# Altium schematic sheet main.SchDoc
size 420 x 297 mm; SheetNumber: 1; SheetTotal: 5
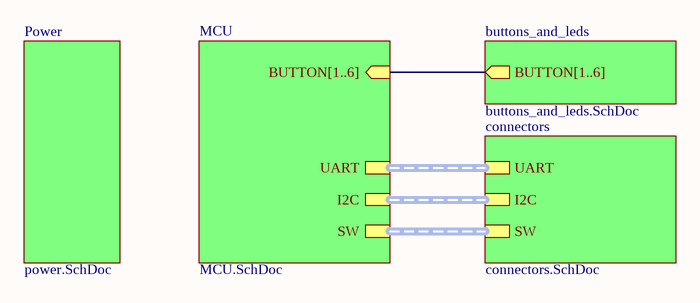
[diagram p0: main.SchDoc]

## Sub-sheets
buttons_and_leds = buttons_and_leds.SchDoc: BUTTON[1..6] (out)
connectors = connectors.SchDoc: UART (harness UART), SW (harness SW), I2C (harness I2C)
MCU = MCU.SchDoc: BUTTON[1..6] (in), UART (harness UART), SW (harness SW), I2C (harness I2C)
Power = power.SchDoc: no entries

## Buses and harness runs
bus sheet buttons_and_leds/BUTTON[1..6] = sheet MCU/BUTTON[1..6]
harness sheet connectors/I2C = sheet MCU/I2C
harness sheet connectors/SW = sheet MCU/SW
harness sheet connectors/UART = sheet MCU/UART

## Notes on the sheet
- Перв. примен.
- Справ. №
- Подп. и дата
- Инв. № дубл.
- Взам. инв. №
- Разраб.
- Изм.
- Лист
- № докум.
- Подп.
- Дата
- Лит.
- Масса
- Масштаб
- Пров.
- Т.контр.
- Схема электрическая принципиальная
- Листов
- Инв. № подл.
- Утв.
- Н.контр.
- Копировал
- Формат А3